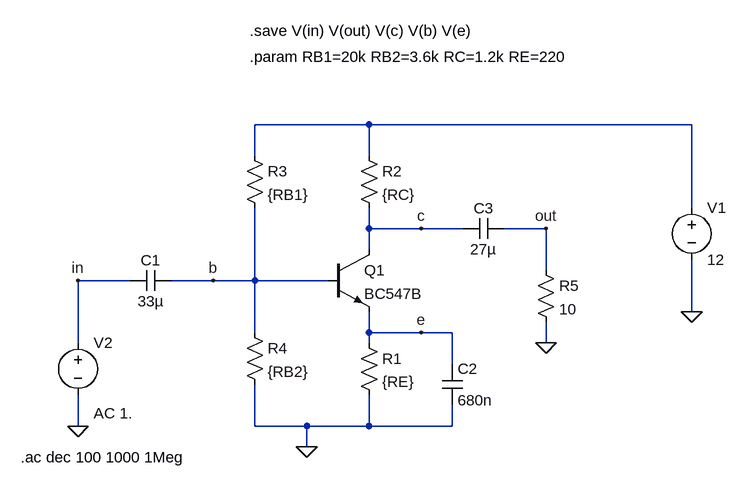
[diagram p0: schematic transistor_polarization.asc]
transistor_polarization.asc, the LTspice schematic file:
Version 4.1
SHEET 1 880 680
WIRE 224 -80 48 -80
WIRE 720 -80 224 -80
WIRE 48 -32 48 -80
WIRE 224 -32 224 -80
WIRE 720 48 720 -80
WIRE 224 80 224 48
WIRE 304 80 224 80
WIRE 368 80 304 80
WIRE 496 80 432 80
WIRE 224 112 224 80
WIRE 496 144 496 80
WIRE -144 160 -224 160
WIRE -16 160 -80 160
WIRE 48 160 48 48
WIRE 48 160 -16 160
WIRE 160 160 48 160
WIRE 720 208 720 128
WIRE 48 240 48 160
WIRE 224 240 224 208
WIRE 304 240 224 240
WIRE 352 240 304 240
WIRE -224 256 -224 160
WIRE 224 256 224 240
WIRE 496 256 496 224
WIRE 352 288 352 240
WIRE -224 384 -224 336
WIRE 48 384 48 320
WIRE 128 384 48 384
WIRE 224 384 224 336
WIRE 224 384 128 384
WIRE 352 384 352 352
WIRE 352 384 224 384
WIRE 128 416 128 384
FLAG 720 208 0
FLAG 128 416 0
FLAG 304 80 c
FLAG 304 240 e
FLAG -16 160 b
FLAG 496 256 0
FLAG -224 384 0
FLAG -224 160 in
FLAG 496 80 out
SYMBOL npn 160 112 R0
SYMATTR InstName Q1
SYMATTR Value BC547B
SYMBOL res 208 240 R0
SYMATTR InstName R1
SYMATTR Value {RE}
SYMBOL res 208 -48 R0
SYMATTR InstName R2
SYMATTR Value {RC}
SYMBOL res 32 -48 R0
SYMATTR InstName R3
SYMATTR Value {RB1}
SYMBOL res 32 224 R0
SYMATTR InstName R4
SYMATTR Value {RB2}
SYMBOL voltage 720 32 R0
WINDOW 123 0 0 Left 0
WINDOW 39 0 0 Left 0
SYMATTR InstName V1
SYMATTR Value 12
SYMBOL cap -80 144 R90
WINDOW 0 0 32 VBottom 2
WINDOW 3 32 32 VTop 2
SYMATTR InstName C1
SYMATTR Value 33µ
SYMBOL cap 336 288 R0
SYMATTR InstName C2
SYMATTR Value 680n
SYMBOL cap 432 64 R90
WINDOW 0 0 32 VBottom 2
WINDOW 3 32 32 VTop 2
SYMATTR InstName C3
SYMATTR Value 27µ
SYMBOL res 480 128 R0
SYMATTR InstName R5
SYMATTR Value 10
SYMBOL voltage -224 240 R0
WINDOW 123 24 124 Left 2
WINDOW 39 0 0 Left 0
SYMATTR Value2 AC 1.
SYMATTR InstName V2
SYMATTR Value ""
TEXT 40 -184 Left 2 !.param RB1=20k RB2=3.6k RC=1.2k RE=220
TEXT -312 432 Left 2 !.ac dec 100 1000 1Meg
TEXT 40 -224 Left 2 !.save V(in) V(out) V(c) V(b) V(e)

The netlist it stands for:
* transistor_polarization.asc
Q1 c b e 0 BC547B
R1 e 0 {RE}
R2 N001 c {RC}
R3 N001 b {RB1}
R4 b 0 {RB2}
V1 N001 0 12
C1 b in 33µ
C2 e 0 680n
C3 out c 27µ
R5 out 0 10
V2 in 0 AC 1.
.model NPN NPN
.model PNP PNP
.lib standard.bjt
.param RB1=20k RB2=3.6k RC=1.2k RE=220
.ac dec 100 1000 1Meg
.save V(in) V(out) V(c) V(b) V(e)
.backanno
.end